# EAGLE design y_carriage_board (EAGLE 7.2.0)
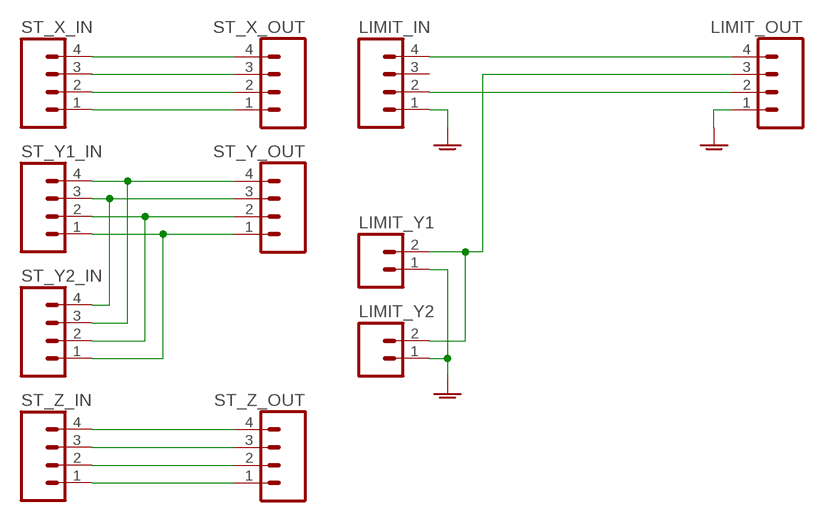
[diagram p0: schematic, sheet 1]

## Parts
LIMIT_IN  M04POLAR  [MOLEX-1X4]
LIMIT_OUT  M04POLAR  [MOLEX-1X4]
LIMIT_Y1  M02POLAR  [MOLEX-1X2]
LIMIT_Y2  M02POLAR  [MOLEX-1X2]
ST_X_IN  M04POLAR  [MOLEX-1X4]
ST_X_OUT  M04POLAR  [MOLEX-1X4]
ST_Y1_IN  M04POLAR  [MOLEX-1X4]
ST_Y2_IN  M04POLAR  [MOLEX-1X4]
ST_Y_OUT  M04POLAR  [MOLEX-1X4]
ST_Z_IN  M04POLAR  [MOLEX-1X4]
ST_Z_OUT  M04POLAR  [MOLEX-1X4]

## Nets
GNDA: LIMIT_IN.1 LIMIT_OUT.1 LIMIT_Y1.1 LIMIT_Y2.1
N$1: ST_X_IN.4 ST_X_OUT.4
N$2: ST_X_IN.3 ST_X_OUT.3
N$3: ST_X_IN.2 ST_X_OUT.2
N$4: ST_X_IN.1 ST_X_OUT.1
N$7: ST_Y1_IN.2 ST_Y2_IN.2 ST_Y_OUT.2
N$8: ST_Y1_IN.1 ST_Y2_IN.1 ST_Y_OUT.1
N$10: LIMIT_IN.4 LIMIT_OUT.4
N$11: LIMIT_OUT.3 LIMIT_Y1.2 LIMIT_Y2.2
N$13: ST_Z_IN.4 ST_Z_OUT.4
N$14: ST_Z_IN.3 ST_Z_OUT.3
N$15: ST_Z_IN.2 ST_Z_OUT.2
N$16: ST_Z_IN.1 ST_Z_OUT.1
N$17: LIMIT_IN.2 LIMIT_OUT.2
N$25: ST_Y1_IN.3 ST_Y2_IN.4 ST_Y_OUT.3
N$26: ST_Y1_IN.4 ST_Y2_IN.3 ST_Y_OUT.4
Unconnected: LIMIT_IN.3

## Library data of the parts
LIMIT_IN LIMIT_OUT ST_X_IN ST_X_OUT ST_Y1_IN ST_Y2_IN ST_Y_OUT ST_Z_IN ST_Z_OUT = SparkFun-Connectors:M04: Header 4 Standard 4-pin 0.1" header. Use with straight break away headers (SKU : PRT-00116), right angle break away headers (PRT-00553), swiss pins (PRT-00743), machine pins (PRT-00117), and female headers (PRT-00115). Molex polarized connector foot print use with SKU : PRT-08231 with associated crimp pins and housings. 1MM SMD Version SKU: PRT-10208
LIMIT_Y1 LIMIT_Y2 = SparkFun-Connectors:M02: Standard 2-pin 0.1" header. Use with - straight break away headers ( PRT-00116) - right angle break away headers (PRT-00553) - swiss pins (PRT-00743) - machine pins (PRT-00117) - female headers (PRT-00115) Molex polarized connector foot print use with: PRT-08233 with associated crimp pins and housings. 2.54_SCREWTERM for use with PRT-10571. 3.5mm Screw Terminal footprints for PRT-08084 5mm Screw Terminal footprints for use with PRT-08433

## Board
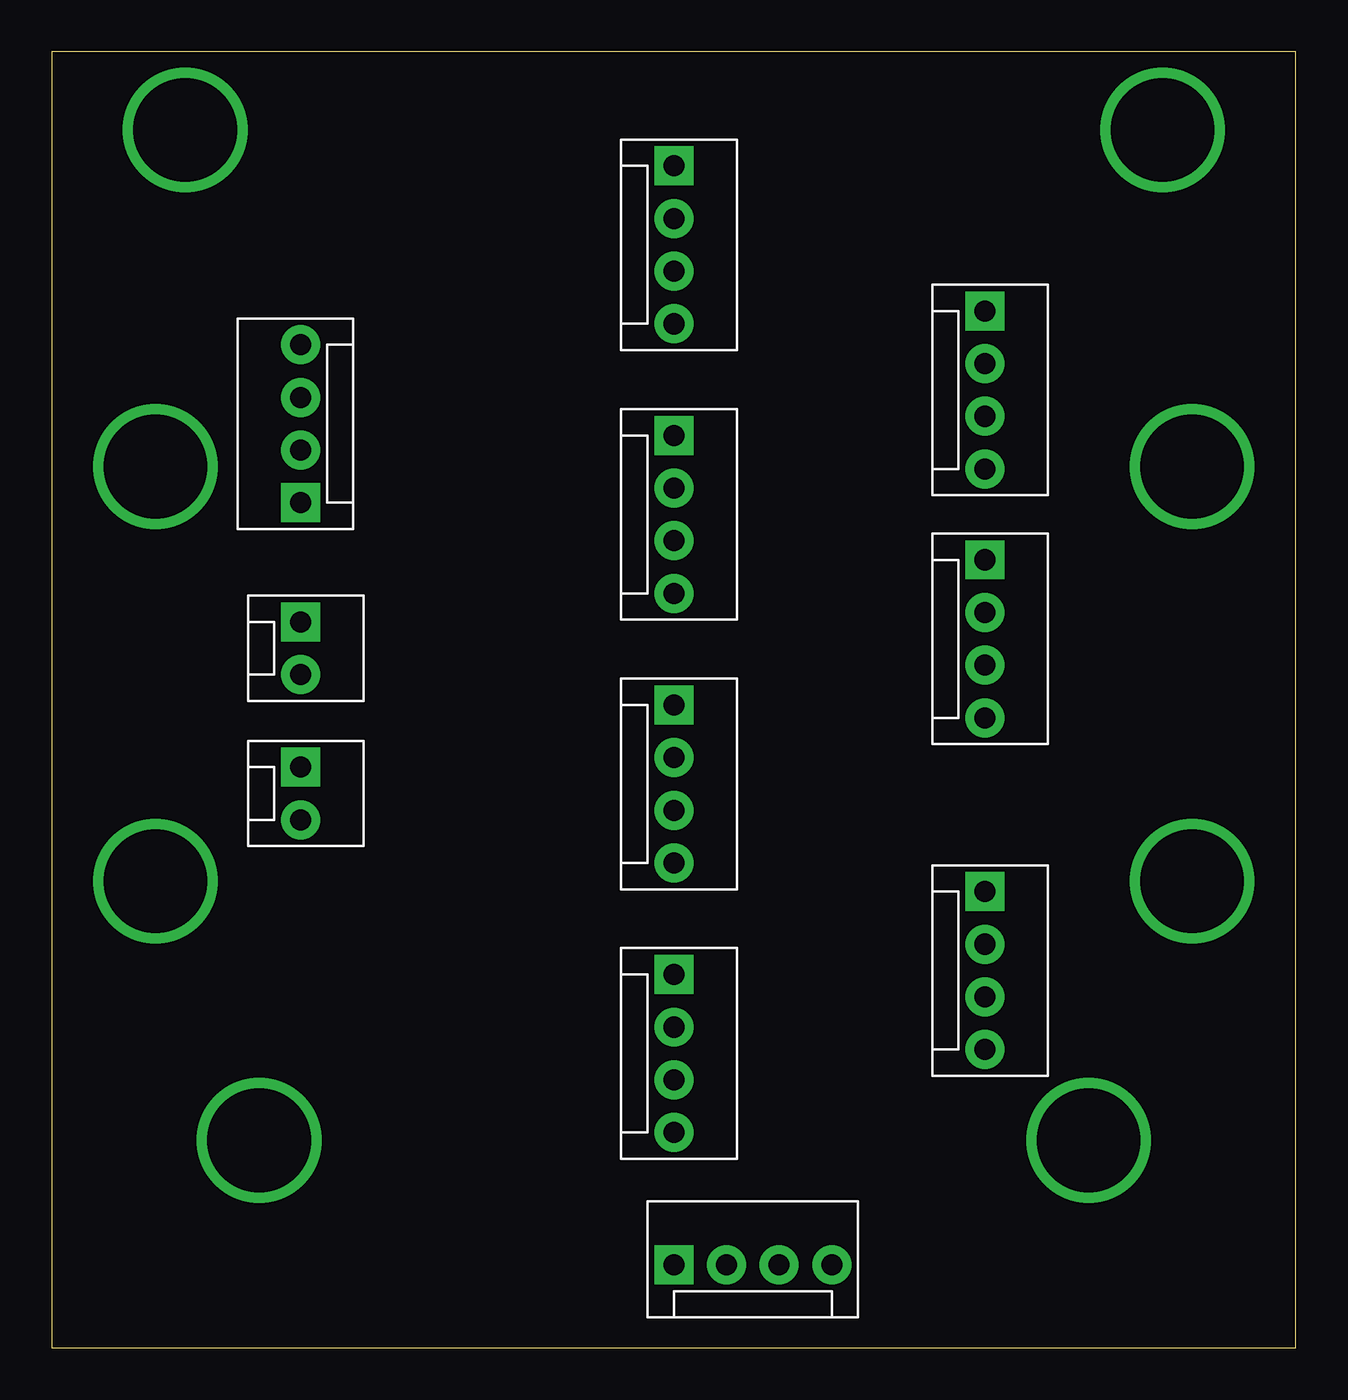
[diagram p1: board, top side]
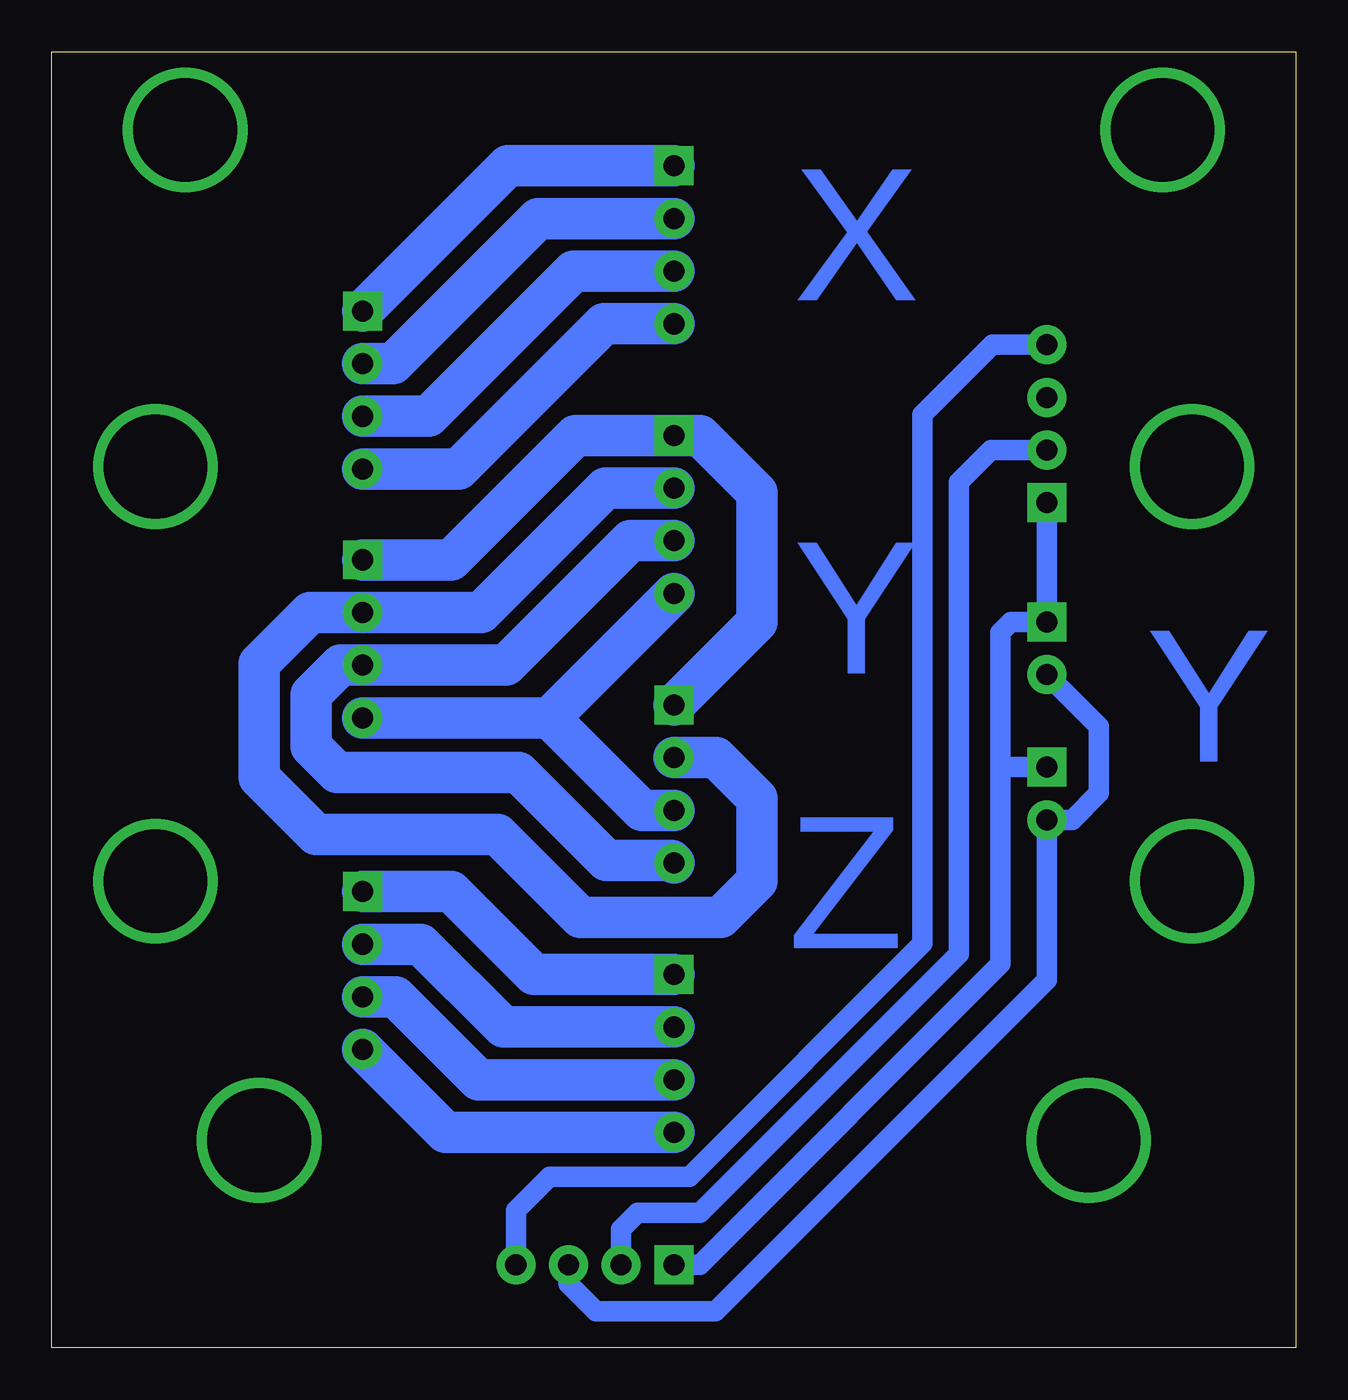
[diagram p2: board, bottom side, seen from below]

Size 60 x 62.5 mm. Coordinates in mm from the lower left corner, seen from the top.
Outline: 0,0 60,0 60,62.5 0,62.5 0,0
Copper layers (1*16): Top 0.035mm / dielectric 1.5mm / Bottom 0.035mm
Design rules "default *": minimum track width 10mil, minimum drill 24mil, track to track 10mil, track to pad 10mil, pad to pad 10mil, via to via 10mil, smd to smd 10mil, copper to edge 20mil, drill to drill 8mil, minimum pad ring 10mil, minimum via ring 8mil, stop-mask expansion 4mil, vias tented up to drill 0mil, thermal gap 10mil

### Footprints (pad centres in the part's own frame; a part is rotated, then mirrored left to right if it is on the bottom)
MOLEX-1X4 = drill 1.016 pad 1.88 square: 1 0,0 | drill 1.016 pad 1.88: 2 2.54,0; 3 5.08,0; 4 7.62,0
MOLEX-1X2 = drill 1.016 pad 1.88 square: 1 0,0 | drill 1.016 pad 1.88: 2 2.54,0

### Placement (x,y rotation side)
LIMIT_IN  12,40.75 90 top
LIMIT_OUT  30,4 0 top
LIMIT_Y1  12,28 270 top
LIMIT_Y2  12,35 270 top
ST_X_IN  30,57 270 top
ST_X_OUT  45,50 270 top
ST_Y1_IN  30,44 270 top
ST_Y2_IN  30,31 270 top
ST_Y_OUT  45,38 270 top
ST_Z_IN  30,18 270 top
ST_Z_OUT  45,22 270 top

### Tracks (layer width: path | path; a pad name or v marks a point on that pad's centre or on a via)
GNDA
  Bottom 1: LIMIT_IN.1 LIMIT_Y2.1 13.75,35 14.25,34.5 14.25,28 | 14.25,28 14.25,18.5 28.75,4 LIMIT_OUT.1 | LIMIT_Y1.1 14.25,28
N$1
  Bottom 2: ST_X_IN.4 33.37,49.38 40.37,42.38 ST_X_OUT.4
N$2
  Bottom 2: ST_X_IN.3 34.83,51.92 41.83,44.92 ST_X_OUT.3
N$3
  Bottom 2: ST_X_IN.2 36.54,54.46 43.54,47.46 ST_X_OUT.2
N$4
  Bottom 2: ST_X_IN.1 38,57 ST_X_OUT.1
N$5  (via drill 5 pad 0.5)
  other vias: 10,10
N$6  (via drill 5 pad 0.5)
  other vias: 50,10
N$7
  Bottom 2: ST_Y1_IN.2 33.29,41.46 39.29,35.46 ST_Y_OUT.2 47.54,35.46 50,33 50,27.5 47.25,24.75 38.5,24.75 34.5,20.75 27.75,20.75 26,22.5 26,26.5 27.96,28.46 ST_Y2_IN.2
N$8
  Bottom 2: ST_Y_OUT.1 40.75,38 34.75,44 ST_Y1_IN.1 28.75,44 26,41.25 26,35 ST_Y2_IN.1
N$9  (via drill 5 pad 0.5)
  other vias: 53.57,58.73
N$10
  Bottom 1: LIMIT_IN.4 14.63,48.37 18,45 18,19.5 29.25,8.25 36,8.25 37.62,6.63 LIMIT_OUT.4
N$11
  Bottom 1: LIMIT_OUT.3 35.08,3.08 33.75,1.75 28,1.75 12,17.75 LIMIT_Y1.2 10.79,25.46 9.5,26.75 9.5,29.96 LIMIT_Y2.2
N$12  (via drill 5 pad 0.5)
  other vias: 6.43,58.73
N$13
  Bottom 2: ST_Z_IN.4 41,10.38 ST_Z_OUT.4
N$14
  Bottom 2: ST_Z_IN.3 39.42,12.92 43.42,16.92 ST_Z_OUT.3
N$15
  Bottom 2: ST_Z_IN.2 38.21,15.46 42.21,19.46 ST_Z_OUT.2
N$16
  Bottom 2: ST_Z_IN.1 36.75,18 40.75,22 ST_Z_OUT.1
N$17
  Bottom 1: LIMIT_IN.2 14.71,43.29 16.25,41.75 16.25,19 28.75,6.5 31.75,6.5 32.54,5.71 LIMIT_OUT.2
N$18  (via drill 5 pad 0.5)
  other vias: 55,42.5
N$19  (via drill 5 pad 0.5)
  other vias: 55,22.5
N$20  (via drill 5 pad 0.5)
  other vias: 5,22.5
N$21  (via drill 5 pad 0.5)
  other vias: 5,42.5
N$25
  Bottom 2: ST_Y1_IN.3 32.08,38.92 38.08,32.92 ST_Y_OUT.3 46.08,32.92 47.5,31.5 47.5,29 46.25,27.75 37.5,27.75 33.25,23.5 30.12,23.5 ST_Y2_IN.4
N$26
  Bottom 2: ST_Y1_IN.4 36,30.38 | 36,30.38 ST_Y_OUT.4 | ST_Y2_IN.3 31.54,25.92 36,30.38

### Text on the board
Bottom: X | Y | Y | Z